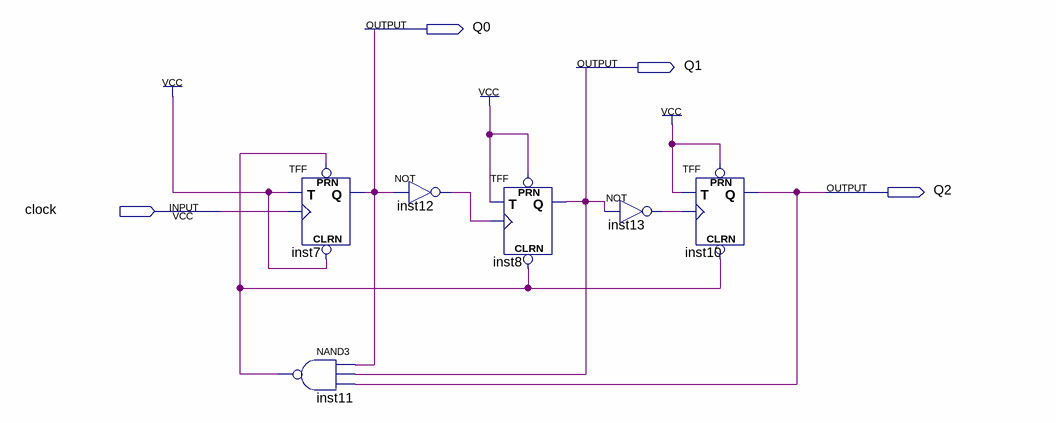
[diagram p0: schematic sheet]
// Quartus schematic mod_6_counter.bdf as structural Verilog: 6 symbols, 4 pins
module mod_6_counter (
  input  clock,
  output Q0,
  output Q1,
  output Q2
);

  wire inst11_out, inst12_out, inst13_out;

  TFF inst7 (.PRN(inst11_out), .CLRN(1'b1), .T(1'b1), .CLK(clock), .Q(Q0));
  nand inst11 (inst11_out, Q0, Q1, Q2);
  not inst12 (inst12_out, Q0);
  TFF inst8 (.PRN(1'b1), .CLRN(inst11_out), .T(1'b1), .CLK(inst12_out), .Q(Q1));
  not inst13 (inst13_out, Q1);
  TFF inst10 (.PRN(1'b1), .CLRN(inst11_out), .T(1'b1), .CLK(inst13_out), .Q(Q2));
endmodule
